# EAGLE design xkid_0.3 (EAGLE 7.1.0)
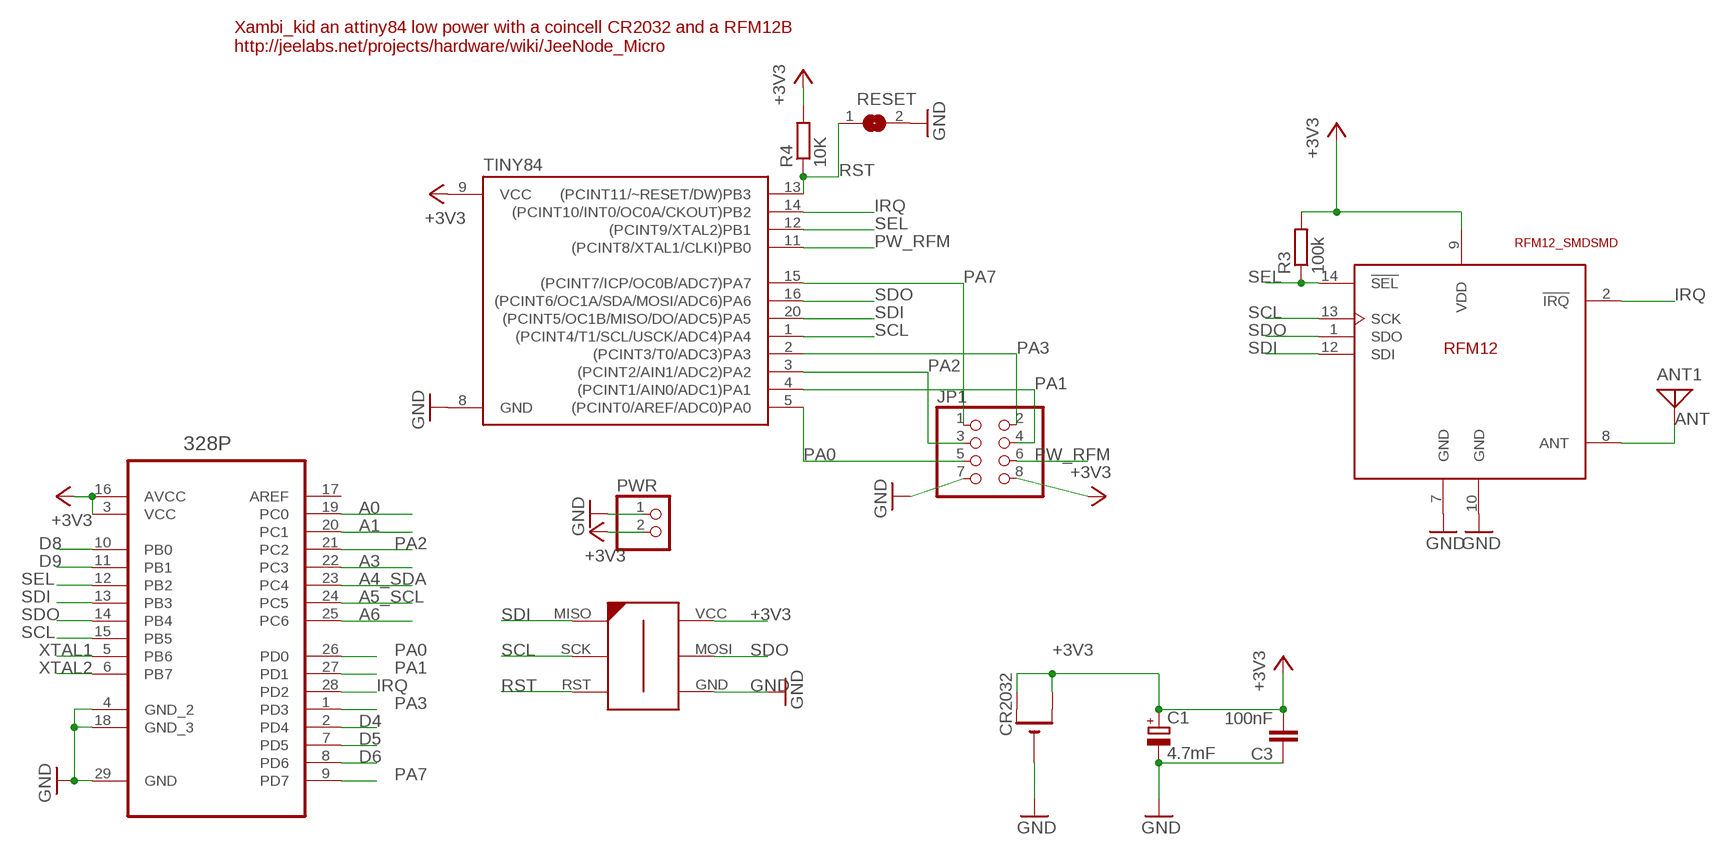
[diagram p0: schematic, sheet 1]

## Parts
328P  ATMEGA328P-MMH  [QFN45P400X400X100-29N]
ANT1  ANTENNA  [PAD-01]
C1  4.7mF  CPOL-EUCT3216  [CT3216]
C3  100nF  C-EUC0805K  [C0805K]
CR2032  CR2032SMT  [CR2032-SMD]
JP1  PINHD-2X4_2.54  [2X04]
PWR  PINHD-1X2  [1X02]
R3  100k  R-EU_R0805  [R0805]
R4  10K  R-EU_R0805  [R0805]
RESET  SJ  [SJ]
TINY84  ATTINY84ATTINY84-20MU  [QFN20]
U$1  RFM12_SMDSMD  [RFM12]
U$2  AVR-ISP-6-EDGE  [6PAD_ISP]

## Nets
+3V3: 328P.3(VCC) 328P.16(AVCC) C1.+ C3.2 CR2032.+$1(+) CR2032.+$2(+1) JP1.8 PWR.2 R3.2 R4.2 TINY84.9(VCC) U$1.9(VDD) U$2.VCC
A0: 328P.19(PC0)
A1: 328P.20(PC1)
A3: 328P.22(PC3)
A4_SDA: 328P.23(PC4)
A5_SCL: 328P.24(PC5)
A6: 328P.25(PC6)
ANT: ANT1.1 U$1.8(ANT)
D4: 328P.2(PD4)
D5: 328P.7(PD5)
D6: 328P.8(PD6)
D8: 328P.10(PB0)
D9: 328P.11(PB1)
GND: 328P.4(GND_2) 328P.18(GND_3) 328P.29(GND) C1.- C3.1 CR2032.- JP1.7 PWR.1 RESET.2 TINY84.8(GND) U$1.7(GND) U$1.10(GND) U$2.GND
IRQ: 328P.28(PD2) TINY84.14((PCINT10/INT0/OC0A/CKOUT)PB2) U$1.2(!IRQ)
PA0: 328P.26(PD0) JP1.5 TINY84.5((PCINT0/AREF/ADC0)PA0)
PA1: 328P.27(PD1) JP1.4 TINY84.4((PCINT1/AIN0/ADC1)PA1)
PA2: 328P.21(PC2) JP1.3 TINY84.3((PCINT2/AIN1/ADC2)PA2)
PA3: 328P.1(PD3) JP1.2 TINY84.2((PCINT3/T0/ADC3)PA3)
PA7: 328P.9(PD7) JP1.1 TINY84.15((PCINT7/ICP/OC0B/ADC7)PA7)
PW_RFM: JP1.6 TINY84.11((PCINT8/XTAL1/CLKI)PB0)
RST: R4.1 RESET.1 TINY84.13((PCINT11/~RESET/DW)PB3) U$2.RST
SCL: 328P.15(PB5) TINY84.1((PCINT4/T1/SCL/USCK/ADC4)PA4) U$1.13(SCK) U$2.SCK
SDI: 328P.13(PB3) TINY84.20((PCINT5/OC1B/MISO/DO/ADC5)PA5) U$1.12(SDI) U$2.MISO
SDO: 328P.14(PB4) TINY84.16((PCINT6/OC1A/SDA/MOSI/ADC6)PA6) U$1.1(SDO) U$2.MOSI
SEL: 328P.12(PB2) R3.1 TINY84.12((PCINT9/XTAL2)PB1) U$1.14(!SEL)
XTAL1: 328P.5(PB6)
XTAL2: 328P.6(PB7)
Unconnected: 328P.17(AREF)

## Notes on the sheet
- Xambi_kid an attiny84 low power with a coincell CR2032 and a RFM12B
  http://jeelabs.net/projects/hardware/wiki/JeeNode_Micro

## Library data of the parts
328P = Atmega328pMLF:ATMEGA328P-MMH: MCU, 8BIT, AVR, MODL,QFN-28; MPN: ATMEGA328P-MMH; OC_FARNELL: 2066295; OC_NEWARK: 68T2937; PACKAGE: QFN-28; SUPPLIER: ATMEL
ANT1 = discrete:ANTENNA: Antenna
C1 = rcl:CPOL-EU: POLARIZED CAPACITOR, European symbol
C3 = rcl:C-EU: CAPACITOR, European symbol
CR2032 = adafruit:CR2032
JP1 = pinhead:PINHD-2X4: PIN HEADER
PWR = pinhead:PINHD-1X2: PIN HEADER
R3 R4 = rcl:R-EU_: RESISTOR, European symbol
RESET = jumper:SJ: SMD solder JUMPER
TINY84 = SparkFun-DigitalIC:ATTINY84: Atmel 14-pin 2/4/8kB flash uC
U$1 = rfm_12:RFM12_SMD: RFM12 is a low costing ISM band transceiver module implemented with unique PLL. It works signal ranges from 315/433/868/915MHZ bands, comply with FCC, ETSI regulation. The SPI interface is used to communicate with microcontroller for parameter setting.
U$2 = avr-7:AVR-ISP-6-EDGE: 6 pin edge connector for ISP with ATMEL MCUs. Developed by Craig Moates (craig at moates dot net). Library by David Blundell (blundar at gmail dot com). Often, even a 6 pin header is really inconvenient for board layout and/or production. This SMD-only header is our de-facto standard for using an edge connector for programming with the help of a 6pin/10pin to edge card adapter.

## Net classes
0 default: width 0.203 mm, clearance 0.152 mm

## Board
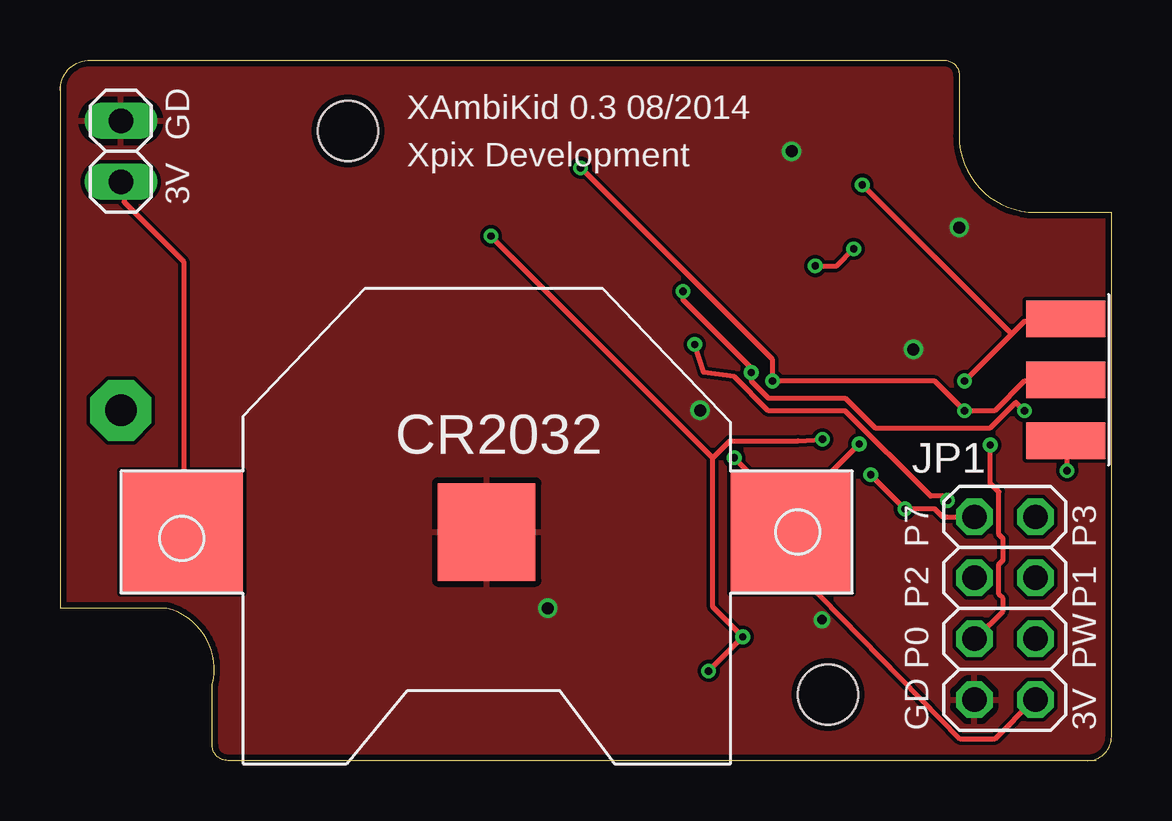
[diagram p1: board, top side]
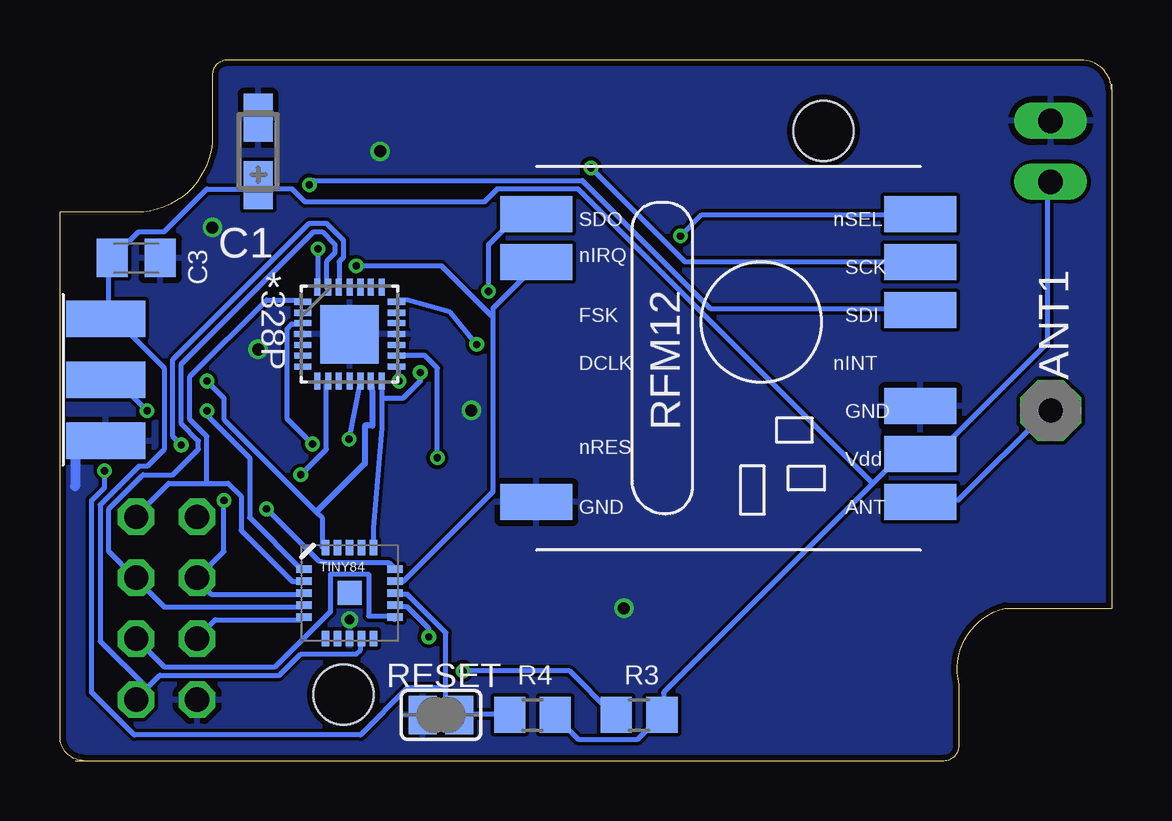
[diagram p2: board, bottom side, seen from below]

Size 43.81 x 29.21 mm. Coordinates in mm from the lower left corner, seen from the top.
Outline: 42.81,0 arc90 43.81,1 43.81,22.86 40.64,22.86 arc-90 37.47,26.04 37.47,28.57 arc90 36.83,29.21 1.27,29.21 arc90 0,27.94
Outline: 0,28.21 0,6.35 4.45,6.35 arc-90 6.35,3.17 6.35,0.64 arc90 6.99,0 43.18,0
Copper layers (1*16): Top 0.035mm / dielectric 1.5mm / Bottom 0.035mm
Design rules "ITEADstudio_DRC": minimum track width 6mil, minimum drill 12mil, track to track 6mil, track to pad 6mil, pad to pad 6mil, via to via 6mil, smd to smd 0mil, copper to edge 10mil, drill to drill 10mil, minimum pad ring 10mil, minimum via ring 6mil, stop-mask expansion 2mil, vias tented up to drill 100mil, thermal gap 10mil
Holes 2.5 mm at 32,2.75 12,26.25

### Footprints (pad centres in the part's own frame; a part is rotated, then mirrored left to right if it is on the bottom)
QFN45P400X400X100-29N = smd 0.711 x 0.254: 1 -1.956,1.346; 2 -1.956,0.889; 3 -1.956,0.457; 4 -1.956,0; 5 -1.956,-0.457; 6 -1.956,-0.889; 7 -1.956,-1.346; 15 1.956,-1.346; 16 1.956,-0.889; 17 1.956,-0.457; 18 1.956,0; 19 1.956,0.457; 20 1.956,0.889; 21 1.956,1.346 | smd 0.254 x 0.711: 8 -1.346,-1.956; 9 -0.889,-1.956; 10 -0.457,-1.956; 11 0,-1.956; 12 0.457,-1.956; 13 0.889,-1.956; 14 1.346,-1.956; 22 1.346,1.956; 23 0.889,1.956; 24 0.457,1.956; 25 0,1.956; 26 -0.457,1.956; 27 -0.889,1.956; 28 -1.346,1.956 | smd 2.438 x 2.438: 29 0,0
PAD-01 = drill 1.321 pad 2.54 octagon: 1 0,0
CT3216 = smd 2 x 1.2: + -1.4,0; - 1.4,0
C0805K = smd 1.3 x 1.6: 1 -1,0; 2 1,0
CR2032-SMD = smd 5.08 x 5.08: +$1 -12.7,0; +$2 12.7,0 | smd 4.064 x 4.064: - 0,0
2X04 = drill 1.016 octagon: 1 -3.81,-1.27; 2 -3.81,1.27; 3 -1.27,-1.27; 4 -1.27,1.27; 5 1.27,-1.27; 6 1.27,1.27; 7 3.81,-1.27; 8 3.81,1.27
1X02 = drill 1.016 long: 1 -1.27,0; 2 1.27,0
R0805 = smd 1.3 x 1.5: 1 -0.95,0; 2 0.95,0
SJ = smd 1.168 x 1.6: 1 -0.762,0; 2 0.762,0
QFN20 = smd 1 x 1: 0 0,0 | smd 0.65 x 0.3: 1 -1.9,1; 2 -1.9,0.5; 3 -1.9,0; 4 -1.9,-0.5; 5 -1.9,-1; 11 1.9,-1; 12 1.9,-0.5; 13 1.9,0; 14 1.9,0.5; 15 1.9,1 | smd 0.3 x 0.65: 6 -1,-1.9; 7 -0.5,-1.9; 8 0,-1.9; 9 0.5,-1.9; 10 1,-1.9; 16 1,1.9; 17 0.5,1.9; 18 0,1.9; 19 -0.5,1.9; 20 -1,1.9
RFM12 = smd 1.5 x 3: 1 -5,-10; 2 -3,-10; 7 7,-10; 8 7,6; 9 5,6; 10 3,6; 12 -1,6; 13 -3,6; 14 -5,6
6PAD_ISP = smd 1.524 x 3.302 bottom: GND 2.54,0; MOSI 0,0; VCC -2.54,0 | smd 1.524 x 3.302: MISO -2.54,0; RST 2.54,0; SCK 0,0

### Placement (x,y rotation side)
328P  31.75,17.78 0 bottom
ANT1  2.54,14.61 270 bottom
C1  35.56,25.4 90 bottom
C3  40.64,20.95 180 bottom
CR2032  17.78,9.53 180 top
JP1  39.37,6.35 270 top
PWR  2.54,25.4 270 top
R3  19.68,1.91 0 bottom
R4  24.13,1.91 0 bottom
RESET  27.94,1.91 180 bottom
TINY84  31.75,6.99 0 bottom
U$1  13.97,17.78 270 bottom
U$2  41.91,15.88 270 top

### Tracks (layer width: path | path; a pad name or v marks a point on that pad's centre or on a via)
+3V3  (via drill 0.3)
  Top 0.203: v28.09,12.62 30.4,10.31 30.4,9.6 CR2032.+$1 | CR2032.+$1 30.58,9.42 30.9,7.66 37.52,0.89 38.94,0.89 40.54,2.49 JP1.8 | CR2032.+$2 5.16,9.6 5.16,20.8 2.67,23.29 2.67,24 PWR.2 | v33.3,13.2 30.45,10.35 CR2032.+$1
  Bottom 0.203: 328P.16 28.63,16.89 28.09,16.36 v28.09,12.62 | 40.18,3.02 40.54,2.67 JP1.8 40.18,3.02 | 40.18,3.02 39.65,3.56 34.67,3.56 33.78,4.45 31.47,4.45 31.29,4.62 31.29,4.98 TINY84.9 | 41.78,18.67 41.78,18.49 U$2.VCC 41.78,18.67 | 41.78,18.67 41.78,20.8 C3.2 41.6,20.98 40.54,22.05 39.47,22.05 37.69,23.82 35.56,23.82 | 40.18,3.02 42.14,4.98 42.14,10.67 40.54,12.27 40.18,12.27 39.47,12.98 39.47,16.36 41.78,18.67 | R4.2 23.11,1.78 22.23,0.89 19.74,0.89 18.85,1.78 R3.2 18.67,1.96 18.67,2.85 9.96,11.56 | 9.96,11.56 8.89,12.62 8,12.62 U$1.9 7.82,12.8 7.29,12.8 2.67,17.42 2.67,24 PWR.2 | 35.56,23.82 34.14,23.82 33.6,23.29 26.14,23.29 25.6,23.82 22.23,23.82 9.96,11.56 | 35.56,23.82 C1.+ | v33.3,13.2 34.35,14.25 34.35,18 34.15,18.2 33.75,18.2 328P.3
ANT
  Bottom 0.203: U$1.8 7.82,10.85 6.4,10.85 2.67,14.58 ANT1.1
GND  (via drill 0.4 pad 0.25, 0.5)
  Bottom 0.406: U$2.GND 43.18,13.34 43.18,11.43
  other vias: 20.32,6.35 30.48,25.4 37.47,22.23 35.56,17.14 26.67,14.61 31.75,5.87
  pour Bottom: 0,0 0,29.21 44.45,29.21 44.45,0
  pour Top: 0,0 0,29.21 44.45,29.21 44.45,0
IRQ  (via drill 0.3)
  Top 0.203: v33.07,21.34 32.36,20.62 v31.47,20.62
  Bottom 0.203: 25.78,18.49 25.78,18.85 24,20.62 U$1.2 | 25.78,18.49 25.78,11.2 29.52,7.47 29.69,7.47 TINY84.14 | v33.07,21.34 33.07,19.74 328P.28 | v31.47,20.62 27.91,20.62 25.78,18.49
PA0  (via drill 0.3)
  Top 0.203: v38.76,13.16 38.76,11.56 39.12,11.2 39.12,9.42 39.29,9.25 39.29,8.36 39.12,8.18 39.12,6.93 39.29,6.76 39.29,6.22 38.23,5.16 JP1.5
  Bottom 0.203: TINY84.5 33.78,5.87 37.34,5.87 38.05,5.16 JP1.5 | v38.76,13.16 39.12,13.51 39.12,16.71 33.43,22.4 32.72,22.4 32,21.69 32,20.98 32.18,20.8 32.18,19.74 328P.26
PA1
  Bottom 0.203: TINY84.4 33.78,6.4 39.47,6.4 40.54,7.47 JP1.4 40.72,7.64 41.78,8.71 41.78,10.49 40.36,11.91 39.12,11.91 38.05,12.98 38.05,13.34 38.76,14.05 38.76,16.54 33.25,22.05 32.89,22.05 32.36,21.51 32.36,21.16 32.72,20.8 32.72,19.74 328P.27
PA2  (via drill 0.3)
  Top 0.203: v26.45,17.35 26.82,16.18 28.09,16 29.52,14.58 32.72,14.58 36.27,11.02 36.8,11.02 v36.98,10.85
  Bottom 0.203: TINY84.3 33.78,6.93 37.52,6.93 38.05,7.47 JP1.3 38.05,7.64 36.98,8.71 v36.98,10.85 | v26.45,17.35 27.56,18.69 29.34,19.2 29.69,19.2 328P.21
PA3
  Bottom 0.203: 37.69,11.56 39.29,11.56 40.54,10.31 JP1.2 | 37.69,11.56 36.8,11.56 36.27,11.02 36.27,9.6 34.14,7.47 33.78,7.47 TINY84.2 | 37.69,11.56 37.69,13.51 38.41,14.22 38.41,16 35.2,19.2 33.78,19.2 328P.1
PA7  (via drill 0.3)
  Top 0.203: JP1.1 38.05,10.13 36.8,10.13 36.45,10.49 v35.2,10.49 v33.78,11.91
  Bottom 0.203: v35.2,10.49 33.03,8.32 33.02,8.32 32.7,8.26 30.12,8.26 TINY84.15 29.87,8 | v33.78,11.91 32.72,12.98 32.72,15.82 328P.9
PW_RFM
  Bottom 0.203: JP1.6 39.47,3.91 34.85,3.91 32.58,6.18 32.54,6.18 32.54,7.78 30.96,7.78 30.96,6.03 29.85,6.03 TINY84.11 29.87,5.87
RST  (via drill 0.3)
  Top 0.203: v41.96,12.09 41.96,13.34 U$2.RST
  Bottom 0.203: 27.74,3.02 27.74,2.49 27.2,1.96 RESET.1 27.03,1.96 25.25,1.96 R4.1 | 27.74,3.02 27.74,5.33 29.34,6.93 29.69,6.93 TINY84.13 | v41.96,12.09 41.96,11.38 42.49,10.85 42.49,2.85 40.72,1.07 31.29,1.07 29.34,3.02 27.74,3.02
SCL  (via drill 0.3)
  Top 0.203: U$2.SCK 41.78,15.82 40.18,15.82 38.94,14.58 v37.69,14.58 36.45,15.82 v29.69,15.82 29.69,16.71 v21.69,24.71
  Bottom 0.203: v37.69,14.58 37.69,14.4 35.92,12.62 35.92,10.13 33.78,8 TINY84.1 | v29.69,15.82 29.69,16.36 328P.15 | v21.69,24.71 17.78,20.8 8,20.8 U$1.13
SDI  (via drill 0.3)
  Top 0.203: 39.65,17.78 40.18,18.31 41.78,18.31 U$2.MISO | 39.65,17.78 v37.69,15.82 | 39.65,17.78 v33.43,24
  Bottom 0.203: v37.69,15.82 36.98,15.11 36.98,14.22 33.13,10.37 32.89,10.13 32.89,8.89 TINY84.20 | v33.43,24 33.25,24.18 22.05,24.18 16.71,18.85 8,18.85 U$1.12
  Bottom 0.254: 328P.13 30.8,15.35 30.8,13.97 31.11,13.97 31.11,12.38 33.13,10.37
SDO  (via drill 0.3)
  Top 0.203: v25.96,19.56 25.96,19.2 28.8,16.36 v28.8,16.18 28.8,15.82 29.52,15.11 32.72,15.11 33.96,13.87 38.76,13.87 39.83,14.94 v40.18,14.58
  Bottom 0.203: 328P.14 30.4,15.11 | 30.4,15.11 30.4,13.87 30.76,9.7 TINY84.16 | v25.96,19.56 25.96,21.51 24.71,22.76 24,22.76 U$1.1 | v28.8,16.18 28.8,15.82 29.52,15.11 30.4,15.11 | v40.18,14.58 41.43,15.82 41.78,15.82 U$2.MOSI
SEL  (via drill 0.3)
  Top 0.203: v27.03,3.73 v28.45,5.16 27.2,6.4 27.2,12.62 | v31.77,13.39 30.76,13.34 27.91,13.34 27.2,12.62 | 27.2,12.62 v17.96,21.87
  Bottom 0.203: v28.45,5.16 28.45,5.51 29.34,6.4 29.69,6.4 TINY84.12 | v27.03,3.73 22.58,3.73 20.8,1.96 R3.1 | v31.77,13.39 328P.12 | v17.96,21.87 17.07,22.76 8,22.76 U$1.14

### Text on the board
tNames: GD | XAmbiKid 0.3 08/2014 / Xpix Development | 3V | P7 | P3 | P2 | P1 | P0 | PW | GD | 3V